# EAGLE design SmartDriveTestStand_SingleCape_v3 (EAGLE 9.2.2)
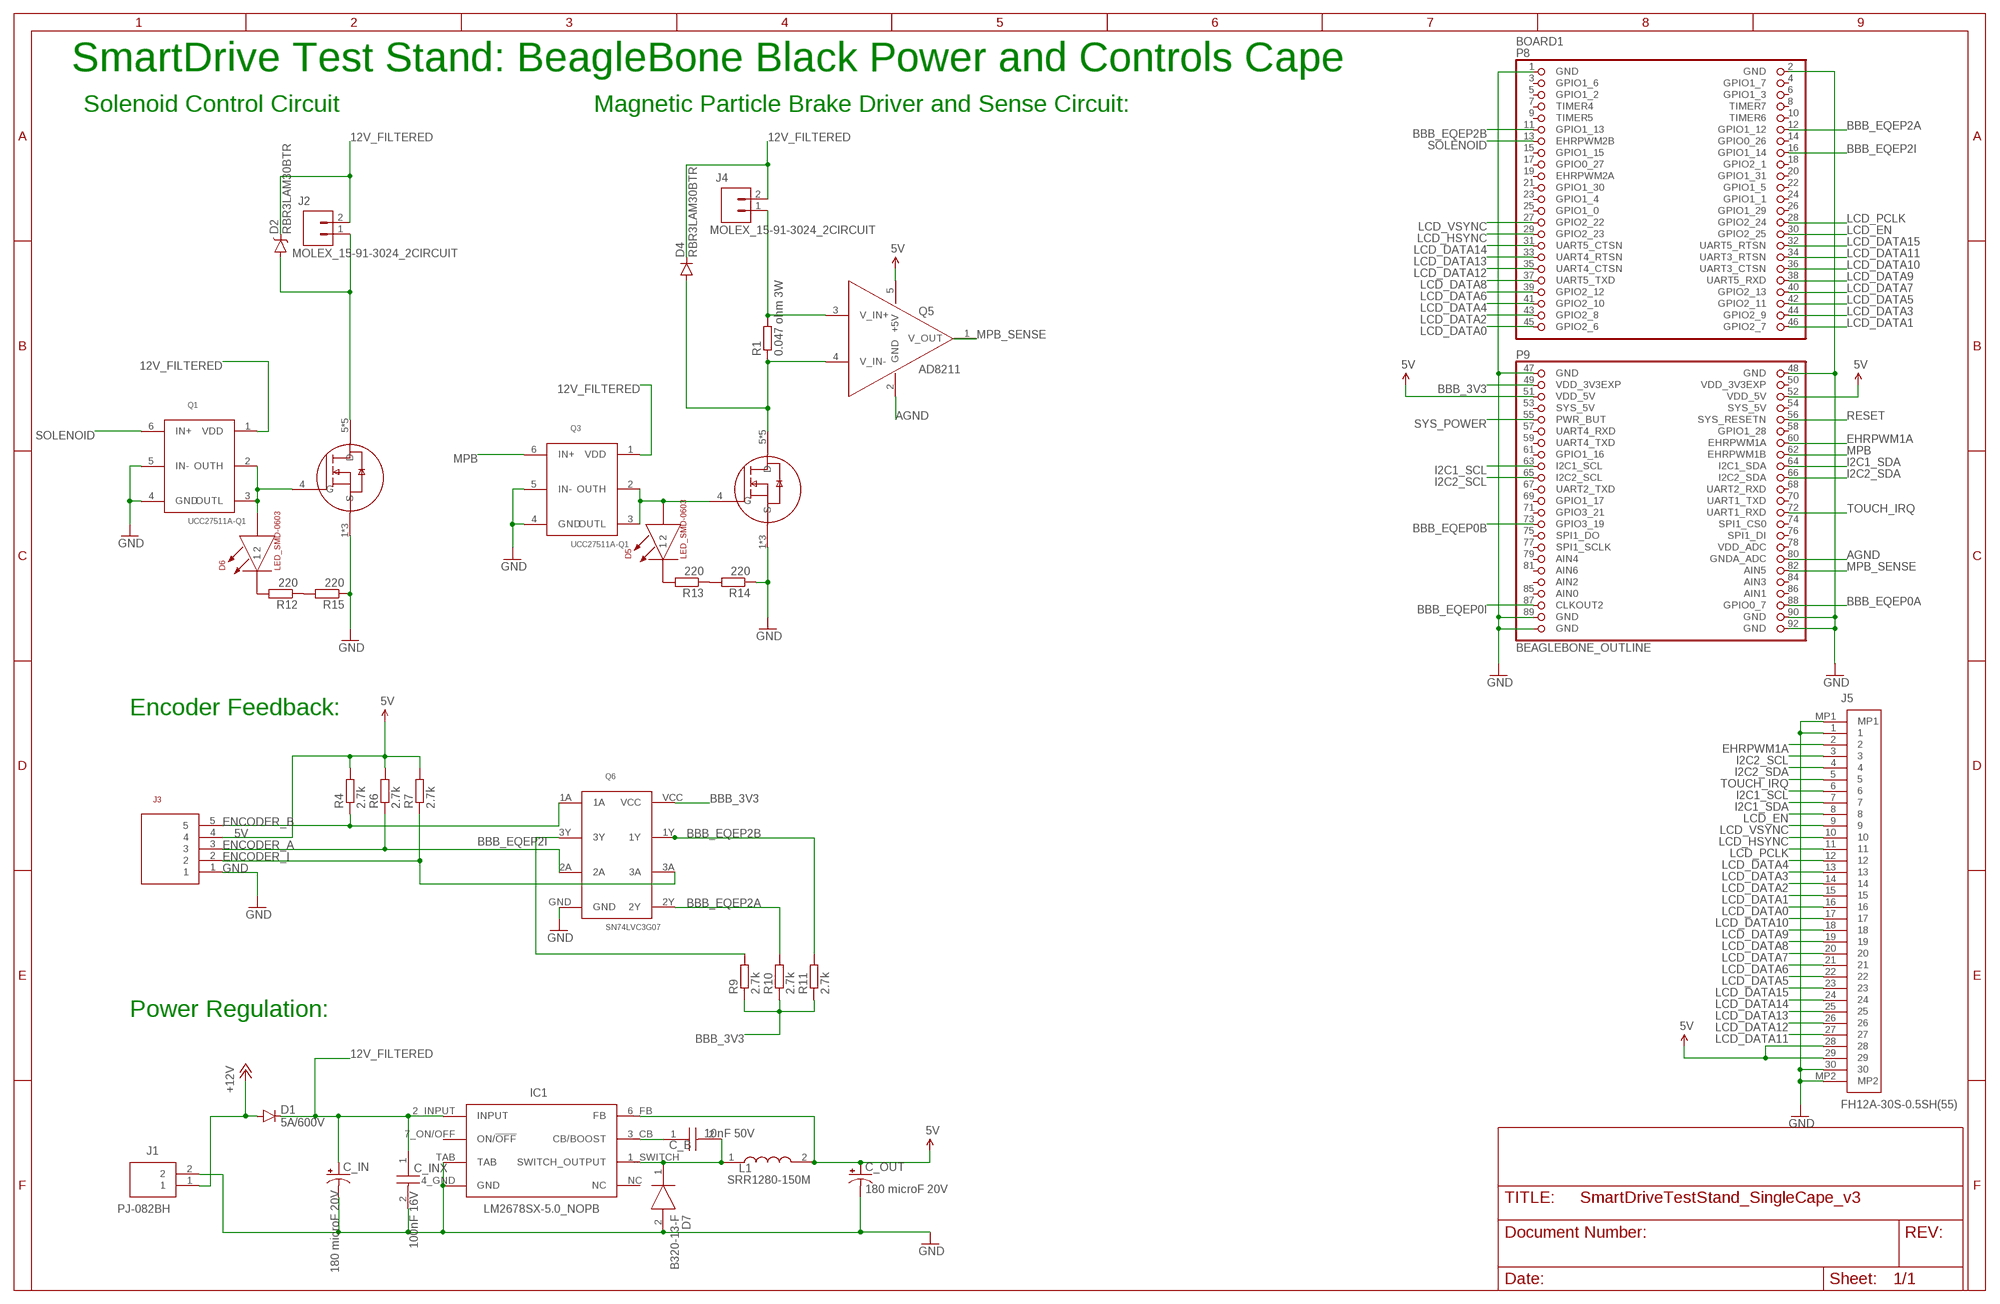
[diagram p0: schematic, sheet 1]

## Parts
BOARD1  BEAGLEBONE_OUTLINE  [BEAGLEBONE_SHIELD]
C_B  10nF 50V  CGA4C2C0G1H103J060AA  [CAPC2012X75N]
C_IN  180 microF 20V  20SVPF180M  [CAPAE1030X800N]
C_INX  100nF 16V  C0603X104K4RACTU  [CAPC1608X90N]
C_OUT  180 microF 20V  20SVPF180M  [CAPAE1030X800N]
D1  5A/600V  DIODEES3J  [SMC]
D2  RBR3LAM30BTR  DIODE-SCHOTTKYRBR3LAM30B  [SMA-DIODE]
D4  RBR3LAM30BTR  DIODESMA  [SMA-DIODE]
D5  LED_SMD-0603  [0603_LED]
D6  LED_SMD-0603  [0603_LED]
D7  B320-13-F  [DIOM7959X250N]
IC1  LM2678SX-5.0_NOPB  [KTW0007B]
J1  PJ-082BH  [PJ-082BH]
J2  MOLEX_15-91-3024_2CIRCUIT  [MOLEX15-91-3024_2CIRCUIT]
J3  MOLEX_15-91-3053_5CIRCUIT  [MOLEX15-91-3053-5CIRCUIT]
J4  MOLEX_15-91-3024_2CIRCUIT  [MOLEX15-91-3024_2CIRCUIT]
J5  FH12A-30S-0.5SH(55)  [FH12A30S05SH55]
L1  SRR1280-150M  [SRR1280-150M]
Q1  UCC27511A-Q1  [SOT23-6]
Q2  MOSFET_NCHANNELTI_CSD18533Q5A  [SON_5X6MM_NEXFET]
Q3  UCC27511A-Q1  [SOT23-6]
Q4  MOSFET_NCHANNELTI_CSD18533Q5A  [SON_5X6MM_NEXFET]
Q5  AD8211  [SOT23-5]
Q6  SN74LVC3G07  [SN74LVC3G07]
R1  0.047 ohm 3W  RESISTOR-2512  [RESISTOR-2512]
R4  2.7k  RESISTOR-0603  [RESISTOR-0603]
R6  2.7k  RESISTOR-0603  [RESISTOR-0603]
R7  2.7k  RESISTOR-0603  [RESISTOR-0603]
R9  2.7k  RESISTOR-0603  [RESISTOR-0603]
R10  2.7k  RESISTOR-0603  [RESISTOR-0603]
R11  2.7k  RESISTOR-0603  [RESISTOR-0603]
R12  220  RESISTOR-0603  [RESISTOR-0603]
R13  220  RESISTOR-0603  [RESISTOR-0603]
R14  220  RESISTOR-0603  [RESISTOR-0603]
R15  220  RESISTOR-0603  [RESISTOR-0603]

## Nets
5V: BOARD1.51(VDD_5V) BOARD1.52(VDD_5V) C_OUT.1(+) IC1.6_FB(FB) J3.4 J5.28 J5.29 L1.2 Q5.5(+5V) R4.P$2 R6.P$2 R7.P$2
12V_FILTERED: C_IN.1(+) C_INX.1 D1.C D2.C D4.C IC1.2_INPUT(INPUT) J2.2 J4.2 Q1.1(VDD) Q3.1(VDD)
+12V: D1.A J1.1
AGND: BOARD1.80(GNDA_ADC) Q5.2(GND)
BBB_3V3: BOARD1.49(VDD_3V3EXP) Q6.VCC R9.P$1 R10.P$1 R11.P$1
BBB_EQEP0A: BOARD1.88(GPIO0_7)
BBB_EQEP0B: BOARD1.73(GPIO3_19)
BBB_EQEP0I: BOARD1.87(CLKOUT2)
BBB_EQEP2A: BOARD1.12(GPIO1_12) Q6.2Y R10.P$2
BBB_EQEP2B: BOARD1.11(GPIO1_13) Q6.1Y R11.P$2
BBB_EQEP2I: BOARD1.16(GPIO1_14) Q6.3Y R9.P$2
EHRPWM1A: BOARD1.60(EHRPWM1A) J5.2
ENCODER_A: J3.3 Q6.2A R6.P$1
ENCODER_B: J3.5 Q6.1A R4.P$1
ENCODER_I: J3.2 Q6.3A R7.P$1
GND: BOARD1.1(GND) BOARD1.2(GND) BOARD1.47(GND) BOARD1.48(GND) BOARD1.89(GND) BOARD1.90(GND) BOARD1.91(GND) BOARD1.92(GND) C_IN.2(-) C_INX.2 C_OUT.2(-) D7.2(A) IC1.4_GND(GND) IC1.TAB J1.2 J3.1 J5.1 J5.30 J5.MP1 J5.MP2 Q1.4(GND) Q1.5(IN-) Q2.1(S) Q2.2(S) Q2.3(S) Q3.4(GND) Q3.5(IN-) Q4.1(S) Q4.2(S) Q4.3(S) Q6.GND R14.P$1 R15.P$1
I2C1_SCL: BOARD1.63(I2C1_SCL) J5.6
I2C1_SDA: BOARD1.64(I2C1_SDA) J5.7
I2C2_SCL: BOARD1.65(I2C2_SCL) J5.3
I2C2_SDA: BOARD1.66(I2C2_SDA) J5.4
LCD_DATA0: BOARD1.45(GPIO2_6) J5.16
LCD_DATA1: BOARD1.46(GPIO2_7) J5.15
LCD_DATA2: BOARD1.43(GPIO2_8) J5.14
LCD_DATA3: BOARD1.44(GPIO2_9) J5.13
LCD_DATA4: BOARD1.41(GPIO2_10) J5.12
LCD_DATA5: BOARD1.42(GPIO2_11) J5.22
LCD_DATA6: BOARD1.39(GPIO2_12) J5.21
LCD_DATA7: BOARD1.40(GPIO2_13) J5.20
LCD_DATA8: BOARD1.37(UART5_TXD) J5.19
LCD_DATA9: BOARD1.38(UART5_RXD) J5.18
LCD_DATA10: BOARD1.36(UART3_CTSN) J5.17
LCD_DATA11: BOARD1.34(UART3_RTSN) J5.27
LCD_DATA12: BOARD1.35(UART4_CTSN) J5.26
LCD_DATA13: BOARD1.33(UART4_RTSN) J5.25
LCD_DATA14: BOARD1.31(UART5_CTSN) J5.24
LCD_DATA15: BOARD1.32(UART5_RTSN) J5.23
LCD_EN: BOARD1.30(GPIO2_25) J5.8
LCD_HSYNC: BOARD1.29(GPIO2_23) J5.10
LCD_PCLK: BOARD1.28(GPIO2_24) J5.11
LCD_VSYNC: BOARD1.27(GPIO2_22) J5.9
MPB: BOARD1.62(EHRPWM1B) Q3.6(IN+)
MPB_SENSE: BOARD1.82(AIN5) Q5.1(V_OUT)
N$1: R13.P$1 R14.P$2
N$2: D4.A Q4.5(D) Q4.6(D) Q4.7(D) Q4.8(D) Q4.PAD(D) Q5.4(V_IN-) R1.1
N$3: D5.C R13.P$2
N$6: D6.C R12.P$2
N$7: D2.A J2.1 Q2.5(D) Q2.6(D) Q2.7(D) Q2.8(D) Q2.PAD(D)
N$8: J4.1 Q5.3(V_IN+) R1.2
N$9: R12.P$1 R15.P$2
N$10: D5.A Q3.2(OUTH) Q3.3(OUTL) Q4.4(G)
N$11: D6.A Q1.2(OUTH) Q1.3(OUTL) Q2.4(G)
N$12: C_B.2 D7.1(K) IC1.1_SWITCH(SWITCH_OUTPUT) L1.1
N$13: C_B.1 IC1.3_CB(CB/BOOST)
RESET: BOARD1.56(SYS_RESETN)
SOLENOID: BOARD1.13(EHRPWM2B) Q1.6(IN+)
SYS_POWER: BOARD1.55(PWR_BUT)
TOUCH_IRQ: BOARD1.72(UART1_RXD) J5.5
Unconnected: BOARD1.3(GPIO1_6) BOARD1.4(GPIO1_7) BOARD1.5(GPIO1_2) BOARD1.6(GPIO1_3) BOARD1.7(TIMER4) BOARD1.8(TIMER7) BOARD1.9(TIMER5) BOARD1.10(TIMER6) BOARD1.14(GPIO0_26) BOARD1.15(GPIO1_15) BOARD1.17(GPIO0_27) BOARD1.18(GPIO2_1) BOARD1.19(EHRPWM2A) BOARD1.20(GPIO1_31) BOARD1.21(GPIO1_30) BOARD1.22(GPIO1_5) BOARD1.23(GPIO1_4) BOARD1.24(GPIO1_1) BOARD1.25(GPIO1_0) BOARD1.26(GPIO1_29) BOARD1.54(SYS_5V) BOARD1.57(UART4_RXD) BOARD1.58(GPIO1_28) BOARD1.59(UART4_TXD) BOARD1.61(GPIO1_16) BOARD1.67(UART2_TXD) BOARD1.68(UART2_RXD) BOARD1.69(GPIO1_17) BOARD1.70(UART1_TXD) BOARD1.71(GPIO3_21) BOARD1.74(SPI1_CS0) BOARD1.75(SPI1_DO) BOARD1.76(SPI1_DI) BOARD1.77(SPI1_SCLK) BOARD1.78(VDD_ADC) BOARD1.79(AIN4) BOARD1.81(AIN6) BOARD1.83(AIN2) BOARD1.84(AIN3) BOARD1.86(AIN1) IC1.7_ON/OFF(ON/!OFF) IC1.NC

## Notes on the sheet
- SmartDrive Test Stand: BeagleBone Black Power and Controls Cape
- Solenoid Control Circuit | Magnetic Particle Brake Driver and Sense Circuit:
- Encoder Feedback:
- Power Regulation:

## Power pins joined to a net without a drawn wire
AIN0: BOARD1.85(AIN0)
SYS_5V: BOARD1.53(SYS_5V)
VDD_3V3EXP: BOARD1.50(VDD_3V3EXP)

## Library data of the parts
BOARD1 = SmartDrive-TestStand:BEAGLEBONE_OUTLINE: Should match A3 pinout - but not completely tested
C_B = SmartDrive-TestStand:CGA4C2C0G1H103J060AA: TDK 2012 CGA 10nF Ceramic Multilayer Capacitor, 50 V dc, +125C, C0G Dielectric, 5% Source: Datasheet <https://componentsearchengine.com/Datasheets/1/CGA4C2C0G1H103J060AA.pdf>; DESCRIPTION: TDK 2012 CGA 10nF Ceramic Multilayer Capacitor, 50 V dc, +125C, C0G Dielectric, 5%; HEIGHT: 0.75mm; MANUFACTURER_NAME: TDK; MANUFACTURER_PART_NUMBER: CGA4C2C0G1H103J060AA; MOUSER_PART_NUMBER: 810-CGA4C2C0G1H103J
C_IN C_OUT = SmartDrive-TestStand:20SVPF180M: Panasonic 180F 20 V dc Polymer Aluminium Electrolytic Capacitor E7, OS-CON Series 5000h 8 x 6.9mm Source: Datasheet <https://componentsearchengine.com/Datasheets/1/20SVPF180M.pdf>; DESCRIPTION: Panasonic 180F 20 V dc Polymer Aluminium Electrolytic Capacitor E7, OS-CON Series 5000h 8 x 6.9mm; HEIGHT: 8mm; MANUFACTURER_NAME: Panasonic; MANUFACTURER_PART_NUMBER: 20SVPF180M; MOUSER_PART_NUMBER: 667-20SVPF180M
C_INX = SmartDrive-TestStand:C0603X104K4RACTU: KEMET 100nF Multilayer Ceramic Capacitor MLCC 16V dc 10% X7R Dielectric 0603 (1608M), Max. Temp. +125C Source: Datasheet <https://componentsearchengine.com/Datasheets/1/C0603X104K4RACTU.pdf>; DESCRIPTION: KEMET 100nF Multilayer Ceramic Capacitor MLCC 16V dc 10% X7R Dielectric 0603 (1608M), Max. Temp. +125C; HEIGHT: 0.9mm; MANUFACTURER_NAME: Kemet; MANUFACTURER_PART_NUMBER: C0603X104K4RACTU; MOUSER_PART_NUMBER: 80-C0603X104K4R
D1 = SmartDrive-TestStand:DIODE: Diode These are standard reverse protection diodes and small signal diodes. SMA package can handle up to about 1A. SOD-323 can handle about 200mA. What the SOD-323 package when ordering, there are some mfgs out there that are 5-pin packages.; MANEX: 130-0001388; PROD_ID: DIO-12441; VALUE: 3A/600V
D2 = SmartDrive-TestStand:DIODE-SCHOTTKY: Schottky diodes
D4 = SmartDrive-TestStand:DIODE: Diode These are standard reverse protection diodes and small signal diodes. SMA package can handle up to about 1A. SOD-323 can handle about 200mA. What the SOD-323 package when ordering, there are some mfgs out there that are 5-pin packages.
D5 D6 = SmartDrive-TestStand:LED_SMD-0603
D7 = SmartDrive-TestStand:B320-13-F: Diodes Inc B320-13-F, SMT Schottky Diode, 20V 3A, 2-Pin DO-214AB Source: Datasheet <https://componentsearchengine.com/Datasheets/1/B320-13-F.pdf>; DESCRIPTION: Diodes Inc B320-13-F, SMT Schottky Diode, 20V 3A, 2-Pin DO-214AB; HEIGHT: 2.5mm; MANUFACTURER_NAME: Diodes Inc.; MANUFACTURER_PART_NUMBER: B320-13-F; MOUSER_PART_NUMBER: 621-B320-F
IC1 = SmartDrive-TestStand:LM2678SX-5.0_NOPB: SIMPLE SWITCHER 8V to 40V, 5A High Efficiency Step-Down DC/DC Switching Regulator Source: Datasheet <http://www.ti.com/lit/gpn/lm2678>; DESCRIPTION: SIMPLE SWITCHER 8V to 40V, 5A High Efficiency Step-Down DC/DC Switching Regulator; HEIGHT: mm; MANUFACTURER_NAME: Texas Instruments; MANUFACTURER_PART_NUMBER: LM2678SX-5.0/NOPB; MOUSER_PART_NUMBER: 926-LM2678SX50NOPB
J1 = SmartDrive-TestStand:PJ-082BH: DC Power Connectors 2.5mm x 5.5mm horz Source: Datasheet <https://componentsearchengine.com/Datasheets/1/PJ-082BH.pdf>; DESCRIPTION: DC Power Connectors 2.5mm x 5.5mm horz; HEIGHT: mm; MANUFACTURER_NAME: CUI; MANUFACTURER_PART_NUMBER: PJ-082BH; MOUSER_PART_NUMBER: 490-PJ-082BH
J2 J4 = SmartDrive-TestStand:MOLEX_15-91-3024_2CIRCUIT: MOLEX 15-91-3024 2 position connector; MANEX: 257-0004040
J3 = SmartDrive-TestStand:MOLEX_15-91-3053_5CIRCUIT
J5 = SmartDrive-TestStand:FH12A-30S-0.5SH(55): Hirose FH12 Series 0.5mm Pitch 30 Way 1 Row Right Angle SMT Female FPC Connector, Gold Plated Contacts Source: Datasheet <https://www.hirose.com/product/en/download_file/key_name/FH12A-30S-0.5SH(55)/category/Drawing (2D)/doc_file_id/43793/?file_category_id=6&item_id=05860556555&is_series=>; ARROW_PART_NUMBER: FH12A-30S-0.5SH(55); ARROW_PRICE-STOCK: https://www.arrow.com/en/products/fh12a-30s-0.5sh-55/hirose-electric; DESCRIPTION: Hirose FH12 Series 0.5mm Pitch 30 Way 1 Row Right Angle SMT Female FPC Connector, Gold Plated Contacts; HEIGHT: 3.6mm; MANUFACTURER_NAME: Hirose; MANUFACTURER_PART_NUMBER: FH12A-30S-0.5SH(55); RS_PART_NUMBER: 7148083P; RS_PRICE-STOCK: http://uk.rs-online.com/web/p/products/7148083P
L1 = SmartDrive-TestStand:SRR1280-150M: Power inductor SMD shielded 15uH Bourns SRR1280 Series Shielded Wire-wound SMD Inductor with a Ferrite Core, 15 H 20% 5.2A Idc Q:26 Source: Datasheet <https://componentsearchengine.com/Datasheets/1/SRR1280-150M.pdf>; DESCRIPTION: Power inductor SMD shielded 15uH Bourns SRR1280 Series Shielded Wire-wound SMD Inductor with a Ferrite Core, 15 H 20% 5.2A Idc Q:26; HEIGHT: mm; MANUFACTURER_NAME: Bourns; MANUFACTURER_PART_NUMBER: SRR1280-150M; MOUSER_PART_NUMBER: 652-SRR1280-150M
Q1 Q3 = SmartDrive-TestStand:UCC27511A-Q1
Q2 Q4 = SmartDrive-TestStand:MOSFET_NCHANNEL: N-Channel QFET MOSFET FQB30N06L 60V, 32A, 35mOhm
Q5 = SmartDrive-TestStand:AD8211: AD8211 Current Sense Amplifier
Q6 = SmartDrive-TestStand:SN74LVC3G07
R1 = SmartDrive-TestStand:RESISTOR-2512: Resistor SMD 2512
R4 R6 R7 R9-R15 = SmartDrive-TestStand:RESISTOR-0603: Resistor 0603 SMD

## Net classes
0 default: width 0.152 mm, drill 0.305 mm, clearance 0.152 mm

## Board
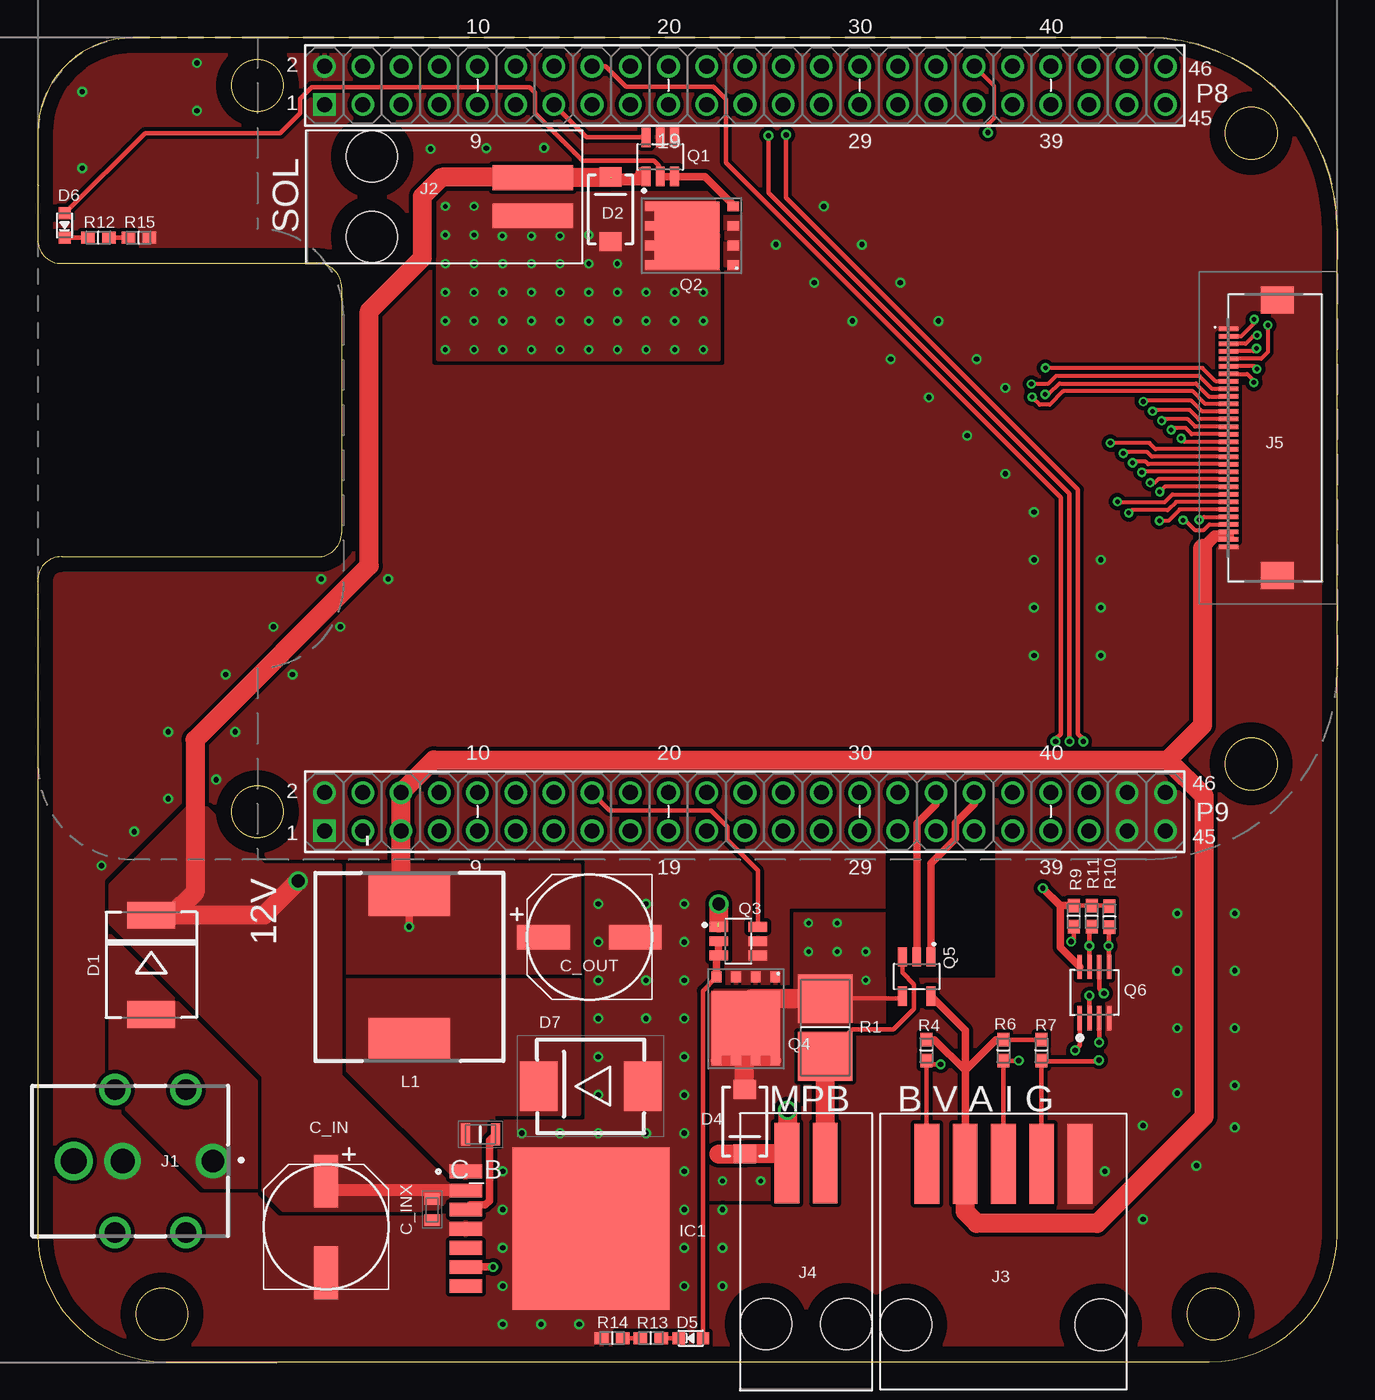
[diagram p1: board, top side]
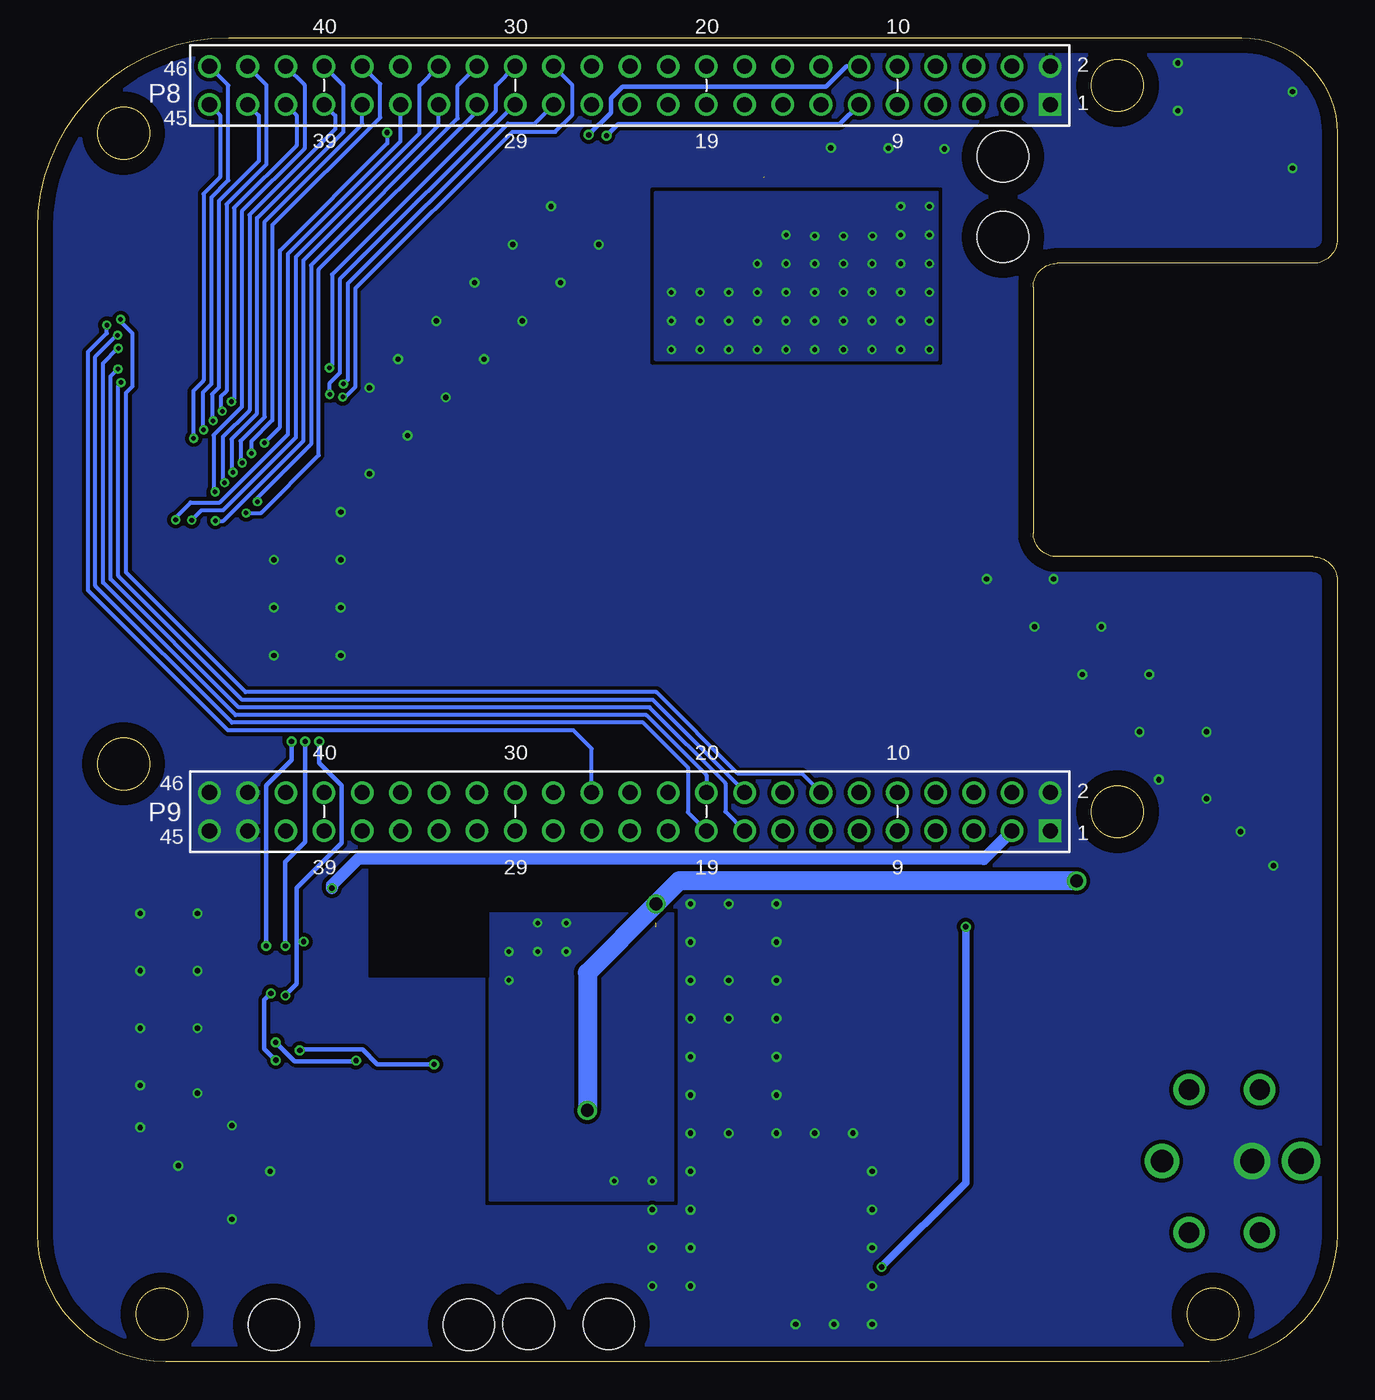
[diagram p2: board, bottom side, seen from below]

Size 86.36 x 88 mm. Coordinates in mm from the lower left corner, seen from the top.
Outline: 0,8.5 arc90 8.5,0 77.86,0 arc90 86.36,8.5 86.36,75.3 arc90 73.66,88 6.35,88 arc90 0,81.65 0,74.59 arc90 1.59,73 18.61,73 arc-90 20.2,71.41 20.2,55.09 arc-90 18.61,53.5 1.59,53.5 arc90 0,51.91 0,8.5
Outline: circle at 14.61,84.83 radius 1.73
Outline: circle at 80.65,81.65 radius 1.73
Outline: circle at 80.65,39.74 radius 1.73
Outline: circle at 14.61,36.56 radius 1.73
Outline: circle at 8.26,3.17 radius 1.73
Outline: circle at 78.11,3.17 radius 1.73
Copper layers (1*16): Top 0.035mm / dielectric 1.5mm / Bottom 0.035mm
Design rules "default *": minimum track width 10mil, minimum drill 10mil, track to track 10mil, track to pad 10mil, pad to pad 10mil, via to via 10mil, smd to smd 8mil, copper to edge 40mil, drill to drill 6mil, minimum pad ring 6mil, minimum via ring 6mil, stop-mask expansion 4mil, vias tented up to drill 15mil, thermal gap 0mil

### Footprints (pad centres in the part's own frame; a part is rotated, then mirrored left to right if it is on the bottom)
BEAGLEBONE_SHIELD = drill 1 square: 1 4.445,19.05; 47 52.705,19.05 | drill 1: 2 1.905,19.05; 3 4.445,21.59; 4 1.905,21.59; 5 4.445,24.13; 6 1.905,24.13; 7 4.445,26.67; 8 1.905,26.67; 9 4.445,29.21; 10 1.905,29.21; 11 4.445,31.75; 12 1.905,31.75; 13 4.445,34.29; 14 1.905,34.29; 15 4.445,36.83; 16 1.905,36.83; 17 4.445,39.37; 18 1.905,39.37; 19 4.445,41.91; 20 1.905,41.91; 21 4.445,44.45; 22 1.905,44.45; 23 4.445,46.99; 24 1.905,46.99; 25 4.445,49.53; 26 1.905,49.53; 27 4.445,52.07; 28 1.905,52.07; 29 4.445,54.61; 30 1.905,54.61; 31 4.445,57.15; 32 1.905,57.15; 33 4.445,59.69; 34 1.905,59.69; 35 4.445,62.23; 36 1.905,62.23; 37 4.445,64.77; 38 1.905,64.77; 39 4.445,67.31; 40 1.905,67.31; 41 4.445,69.85; 42 1.905,69.85; 43 4.445,72.39; 44 1.905,72.39; 45 4.445,74.93; 46 1.905,74.93; 48 50.165,19.05; 49 52.705,21.59; 50 50.165,21.59; 51 52.705,24.13; 52 50.165,24.13; 53 52.705,26.67; 54 50.165,26.67; 55 52.705,29.21; 56 50.165,29.21; 57 52.705,31.75; 58 50.165,31.75; 59 52.705,34.29; 60 50.165,34.29; 61 52.705,36.83; 62 50.165,36.83; 63 52.705,39.37; 64 50.165,39.37; 65 52.705,41.91; 66 50.165,41.91; 67 52.705,44.45; 68 50.165,44.45; 69 52.705,46.99; 70 50.165,46.99; 71 52.705,49.53; 72 50.165,49.53; 73 52.705,52.07; 74 50.165,52.07; 75 52.705,54.61; 76 50.165,54.61; 77 52.705,57.15; 78 50.165,57.15; 79 52.705,59.69; 80 50.165,59.69; 81 52.705,62.23; 82 50.165,62.23; 83 52.705,64.77; 84 50.165,64.77; 85 52.705,67.31; 86 50.165,67.31; 87 52.705,69.85; 88 50.165,69.85; 89 52.705,72.39; 90 50.165,72.39; 91 52.705,74.93; 92 50.165,74.93
CAPC2012X75N = smd 0.62 x 1.47: 1 -1,0; 2 1,0
CAPAE1030X800N = smd 3.5 x 1.6: 1 -3.05,0; 2 3.05,0
CAPC1608X90N = smd 0.78 x 0.98: 1 -0.7,0; 2 0.7,0
SMC = smd 1.778 x 3.175: A 3.302,0; C -3.302,0
SMA-DIODE = smd 1.27 x 1.47: A -2.15,0; C 2.15,0
0603_LED = smd 0.8 x 0.8: A 0.8,0; C -0.8,0
DIOM7959X250N = smd 2.5 x 3.3: 1 -3.45,0; 2 3.45,0
KTW0007B = smd 2.159 x 0.914: 1_SWITCH 8.331,-3.81; 2_INPUT 8.331,-2.54; 3_CB 8.331,-1.27; 4_GND 8.331,0; 6_FB 8.331,2.54; 7_ON/OFF 8.331,3.81; NC 8.331,1.27 | smd 10.414 x 10.795: TAB 0,0
PJ-082BH = drill 1.5 pad 2.3: 1 12,0 | drill 1.61 pad 2.4: 2 6,0 | drill 1.7 pad 2.5: 3 2.75,0 | drill 1.35 pad 2.1: 4 5.5,4.75; 5 10.2,4.75; 6 10.2,-4.75; 7 5.5,-4.75
MOLEX15-91-3024_2CIRCUIT = smd 1.65 x 5.33: 1 1.27,10.69; 2 -1.27,10.69 | hole 3.4: 2.67,0; -2.67,0
MOLEX15-91-3053-5CIRCUIT = smd 1.65 x 5.33: 1 5.08,10.69; 2 2.54,10.69; 3 0,10.69; 4 -2.54,10.69; 5 -5.08,10.69 | hole 3.4: 6.48,0; -6.48,0
FH12A30S05SH55 = smd 0.3 x 1.3: 1 -7.25,-2.625; 2 -6.75,-2.625; 3 -6.25,-2.625; 4 -5.75,-2.625; 5 -5.25,-2.625; 6 -4.75,-2.625; 7 -4.25,-2.625; 8 -3.75,-2.625; 9 -3.25,-2.625; 10 -2.75,-2.625; 11 -2.25,-2.625; 12 -1.75,-2.625; 13 -1.25,-2.625; 14 -0.75,-2.625; 15 -0.25,-2.625; 16 0.25,-2.625; 17 0.75,-2.625; 18 1.25,-2.625; 19 1.75,-2.625; 20 2.25,-2.625; 21 2.75,-2.625; 22 3.25,-2.625; 23 3.75,-2.625; 24 4.25,-2.625; 25 4.75,-2.625; 26 5.25,-2.625; 27 5.75,-2.625; 28 6.25,-2.625; 29 6.75,-2.625; 30 7.25,-2.625 | smd 1.8 x 2.2: MP1 -9.15,0.625; MP2 9.15,0.625
SRR1280-150M = smd 2.9 x 5.4: 1 -4.85,0; 2 4.85,0
SOT23-6 = smd 1.27 x 0.635: 1 -1.3,0.95; 2 -1.3,0; 3 -1.3,-0.95; 4 1.3,-0.95; 5 1.3,0; 6 1.3,0.95
SON_5X6MM_NEXFET = smd 0.75 x 0.65: 1 3.075,-1.95; 2 3.075,-0.65; 3 3.075,0.65; 4 3.075,1.95 | smd 0.65 x 0.65: 5 -2.475,1.95; 6 -2.475,0.65; 7 -2.475,-0.65; 8 -2.475,-1.95 | smd 4.3 x 4.55: PAD 0,0
SOT23-5 = smd 1.27 x 0.635: 1 -1.3,0.95; 2 -1.3,0; 3 -1.3,-0.95; 4 1.3,-0.95; 5 1.3,0.95
SN74LVC3G07 = smd 0.3 x 1.6: 1A -0.975,-1.7; 1Y -0.325,1.7; 2A 0.325,-1.7; 2Y 0.975,1.7; 3A 0.325,1.7; 3Y -0.325,-1.7; GND 0.975,-1.7; VCC -0.975,1.7
RESISTOR-2512 = smd 3.25 x 3.6: 1 -1.925,0; 2 1.925,0
RESISTOR-0603 = smd 0.9 x 0.8: P$1 -0.7,0; P$2 0.7,0

### Placement (x,y rotation side)
BOARD1  0.01,88 270 top
C_B  29.43,15.12 180 top
C_IN  19.17,8.97 270 top
C_INX  26.21,10.12 270 top
C_OUT  36.67,28.23 0 top
D1  7.55,26.39 270 top
D2  38.07,76.59 90 top
D4  46.99,15.96 270 top
D5  43.4,1.58 0 top
D6  1.8,75.52 90 top
D7  36.75,18.32 0 top
DRILEGEND  [DRILEGEND]  10.55,33.13 0 top
IC1  36.78,8.85 180 top
J1  -0.35,13.35 0 top
J2  22.22,77.43 270 top
J3  64.18,2.47 0 top
J4  51.07,2.51 0 top
J5  81.76,61.4 270 top
L1  24.71,26.25 90 top
Q1  41.37,80.07 90 top
Q2  43.15,74.83 0 top
Q3  46.56,27.96 0 top
Q4  47.07,22.5 90 top
Q5  58.42,25.61 270 top
Q6  70.23,24.54 0 top
R1  52.34,22.22 270 top
R4  59.06,20.71 90 top
R6  64.17,20.71 90 top
R7  66.7,20.71 90 top
R9  68.86,29.62 270 top
R10  71.23,29.6 270 top
R11  70.05,29.62 270 top
R12  4.03,74.72 180 top
R13  40.74,1.58 0 top
R14  38.17,1.58 0 top
R15  6.73,74.72 180 top

### Tracks (layer width: path | path; a pad name or v marks a point on that pad's centre or on a via)
5V  (via drill 0.35)
  Top 0.254: 79.14,54.88 J5.29 J5.28
  Top 0.305: R6.P$2 R7.P$2
  Top 0.508: IC1.6_FB v30.27,6.31 | v24.68,28.91 24.68,31.07 L1.2 | J3.4 61.64,19.36 | 61.64,19.36 61.64,22.04 Q5.5 | R4.P$2 59.59,21.41 61.64,19.36 | 61.64,19.36 63.69,21.41 R6.P$2
  Top 0.762: 77.41,54.06 78.24,54.88 79.14,54.88
  Top 1.27: 75.12,40.01 26.32,40.01 BOARD1.52 BOARD1.51 24.14,31.66 L1.2 | 75.12,40.01 77.5,37.63 77.5,16.29 70.41,9.2 62.42,9.2 61.63,9.99 61.63,13.15 J3.4 | 75.12,40.01 77.41,42.31 77.41,54.06
  Bottom 0.508: v30.27,6.31 24.68,11.89 v24.68,28.91
  pour Top (rank 3): 20.11,32.98 20.11,25.36 35.99,25.36 35.99,32.98
12V_FILTERED  (via drill 0.85)  (2 unrouted)
  Top 0.305: C_INX.1 26.78,11.39 IC1.2_INPUT
  Top 0.508: 38.19,78.77 38.11,78.7 | 40.1,79 40.1,78.77 Q1.1
  Top 0.813: IC1.2_INPUT 19.81,11.39 C_IN.1 | 38.28,78.53 D2.C 38.25,78.56 40.1,78.56 40.1,79
  Top 1.27: J2.2 32.88,78.72 26.84,78.72 25.57,77.45 25.57,73.37 22.04,69.84 22.04,52.9 10.47,41.33 10.47,31.21 8.95,29.69 D1.C 15.05,29.69 v17.32,31.96 | J2.2 32.96,78.75 | 45.27,13.81 D4.C 49.19,13.81 J4.2 49.83,13.2 v49.83,16.72 | v45.26,30.44 v45.26,30.43 45.26,29.16 | J2.2 32.91,78.74 D2.C
  Bottom 1.27: v17.32,31.96 43.73,31.96 v45.26,30.44 49.83,25.86 v49.83,16.72
  pour Top: 4.87,29.17 15.03,19.01 15.03,11.39 16.3,10.12 26.46,10.12 27.73,11.39 20.11,19.01 20.11,32.98 15.03,32.98 11.22,36.79 9.95,36.79 4.87,31.71
+12V
  pour Top (rank 2): 15.03,11.64 11.1,11.64 4.87,17.86 4.87,29.17 15.03,19.01
AGND
  Top 0.508: Q5.2 58.42,34.76 58.42,34.77 58.42,35.79 59.18,36.55 59.2,36.55 59.7,37.05 BOARD1.80
AGND_CUTOUT
  cutout Top: 56.43,25.61 56.43,38.56 63.55,38.56 63.55,25.61
  cutout Bottom: 56.43,38.56 56.43,25.61 64.31,25.61 64.31,38.56
BBB_3V3  (via drill 0.35)
  Top 0.305: R10.P$1 71.2,30.32 R11.P$1 R9.P$1
  Top 0.508: 67.95,30.32 v66.8,31.48 67.84,30.43 | 67.95,30.32 R9.P$1 | Q6.VCC 67.95,27.54 67.95,30.32
  Bottom 0.813: BOARD1.49 23.49,33.41 65.07,33.41 66.8,31.68 v66.8,31.48
BBB_EQEP2A  (via drill 0.35)
  Top 0.305: Q6.2Y 71.2,27.61 v71.17,27.64 71.19,27.67 71.19,28.86 R10.P$2 | v69.49,41.23 69.49,41.38 69.13,41.74 69.13,57.96 49.74,77.35 v49.74,81.54
  Bottom 0.305: v49.74,81.54 48.26,83.02 48.26,83.96 47.49,84.73 33.97,84.73 32.61,86.09 BOARD1.12 | v69.49,41.23 69.49,39.99 71.17,38.31 v71.17,27.64
BBB_EQEP2B  (via drill 0.35)
  Top 0.305: Q6.1Y v69.9,27.64 69.9,28.76 R11.P$2 | v68.58,41.23 68.58,57.69 48.56,77.7 v48.56,81.49
  Bottom 0.305: v48.56,81.49 47.8,82.25 33.06,82.25 BOARD1.11 | v69.9,27.64 69.9,33.23 68.58,34.55 v68.58,41.23
BBB_EQEP2I  (via drill 0.35)
  Top 0.305: BOARD1.16 37.74,86.09 39.1,84.73 44.92,84.73 45.75,83.91 45.75,79.68 67.99,57.44 67.99,41.73 67.64,41.38 v67.64,41.23 | Q6.3Y v69.9,24.34 | v68.68,27.92 68.86,28.1 R9.P$2
  Bottom 0.305: 69.13,27.92 69.13,31.5 66.17,34.47 66.17,38.31 67.64,39.79 v67.64,41.23 | 69.13,27.92 69.13,25.1 v69.9,24.34 | 69.13,27.92 v68.68,27.92
EHRPWM1A  (via drill 0.3)
  Top 0.254: J5.2 79.98,68.15 80.84,69.02 v80.84,69.27
  Bottom 0.254: v80.84,69.27 80.84,69.12 80.06,68.33 80.06,64.83 80.49,64.4 80.49,52.46 72.54,44.51 45.25,44.51 39.84,39.1 35.57,39.1 BOARD1.60
ENCODER_A  (via drill 0.35)
  Top 0.305: J3.3 R6.P$1 65.19,20.01 v65.2,20.02 | v70.53,21.24 70.55,21.26 Q6.2A
  Bottom 0.305: v65.2,20.02 65.25,19.97 69.27,19.97 v70.53,21.24
ENCODER_B  (via drill 0.35)
  Top 0.305: J3.5 59.06,13.2 R4.P$1 59.3,19.77 v60.01,19.77 | v68.94,20.7 69.25,21.02 Q6.1A
  Bottom 0.305: v60.01,19.77 63.78,19.77 64.77,20.76 68.89,20.76 v68.94,20.7
ENCODER_I  (via drill 0.35)
  Top 0.305: J3.2 66.7,13.18 R7.P$1 66.75,19.96 70.44,19.96 v70.53,20.05 | Q6.3A 70.56,24.8 v70.86,24.49
  Bottom 0.305: v70.86,24.49 71.29,24.06 71.29,20.81 v70.53,20.05
GND  (via drill 0.35)
  other vias: 75.74,17.86 75.74,25.99 73.45,15.7 70.91,12.66 75.74,22.18 75.74,29.8 13.13,41.87 16.94,45.68 20.11,48.85 23.29,52.03 18.84,52.03 15.67,48.85 12.49,45.68 8.68,41.87 11.86,38.69 6.42,35.24 26.11,80.6 33.65,80.68 10.59,83.14 10.59,86.32 2.97,84.41 2.97,79.33 4.24,32.98 42.97,30.44 42.97,27.9 42.97,25.36 42.97,22.82 42.97,20.28 40.43,30.44 37.26,30.44 37.26,27.9 37.26,25.36 40.43,25.36 40.43,22.82 37.26,22.82 37.26,20.28 37.26,17.74 37.26,15.2 40.43,15.2 42.97,15.2 42.97,17.74 42.97,12.66 42.97,10.12 42.97,7.58 42.97,5.04 34.72,15.2 32.18,15.2 30.91,12.66 30.91,10.12 30.91,7.58 30.91,5.04 30.91,2.5 33.45,2.5 79.55,29.8 79.55,25.99 79.55,22.18 79.55,18.37 79.55,15.58 77.01,13.04 73.45,9.48 8.68,37.42 45.51,10.12 45.51,7.58 45.51,5.04 35.99,2.5 70.66,46.95 70.66,50.12 70.66,53.3 66.21,46.95 66.21,50.12 66.21,53.3 66.21,56.47 64.31,59.01 61.77,61.55 59.23,64.09 56.69,66.63 54.15,69.17 51.61,71.71 49.07,74.25 52.24,76.79 54.78,74.25 57.32,71.71 59.86,69.17 62.4,66.63 64.31,64.73 29.82,80.65
  pour Bottom (rank 6): -0.34,89.01 -0.34,-1.49 91.2,-1.49 91.2,89.01
  pour Top (rank 6): -0.11,89.01 -0.11,-1.41 91.17,-1.41 91.17,89.01
I2C1_SCL  (via drill 0.3)
  Top 0.254: J5.6 80.84,66.16 v81.02,65.98
  Bottom 0.254: v81.02,65.98 v81.03,65.98 81.5,65.5 81.5,52.01 72.99,43.49 45.69,43.49 40.66,38.46 40.66,36.57 BOARD1.63
I2C1_SDA  (via drill 0.3)
  Top 0.254: J5.7 80.38,65.65 80.82,65.21 v80.82,65.08
  Bottom 0.254: BOARD1.64 39.38,37.91 45.47,44 72.76,44 81,52.23 81,64.88 80.82,65.06 v80.82,65.08
I2C2_SCL  (via drill 0.3)
  Top 0.254: J5.3 80.28,67.65 80.86,68.22 v81.05,68.22
  Bottom 0.254: v81.05,68.22 81.1,68.22 82.52,66.81 82.52,51.56 73.43,42.48 46.12,42.48 43.15,39.5 43.15,36.52 BOARD1.65
I2C2_SDA  (via drill 0.3)
  Top 0.254: J5.4 80.79,67.15 v81,67.35
  Bottom 0.254: v81,67.35 81.02,67.35 82.01,66.36 82.01,51.79 73.21,42.98 45.91,42.98 41.92,39 BOARD1.66
LCD_DATA0  (via drill 0.3)
  Top 0.254: J5.16 76.21,61.15 v75.99,61.37
  Bottom 0.254: v75.99,61.37 76.02,61.4 76.02,64.52 75.33,65.21 75.33,77.63 74.23,78.73 74.23,82.84 BOARD1.45
LCD_DATA1  (via drill 0.3)
  Top 0.254: J5.15 76.7,61.65 76.29,62.06 75.46,62.06 v75.33,61.93
  Bottom 0.254: v75.33,61.93 75.38,61.98 75.38,64.42 74.82,64.98 74.82,77.37 73.69,78.51 73.69,84.83 BOARD1.46
LCD_DATA2  (via drill 0.3)
  Top 0.254: v74.7,62.54 74.8,62.64 76.44,62.64 76.93,62.15 J5.14
  Bottom 0.254: v74.7,62.54 74.77,62.62 74.77,64.29 74.32,64.75 74.32,77.14 71.67,79.79 71.67,82.81 BOARD1.43
LCD_DATA3  (via drill 0.3)
  Top 0.254: J5.13 77.16,62.64 76.56,63.25 74.16,63.25 v74.09,63.18
  Bottom 0.254: v74.09,63.18 74.19,63.28 74.19,64.14 73.81,64.52 73.81,76.92 71.14,79.58 71.14,84.84 72.39,86.09 BOARD1.44
LCD_DATA4  (via drill 0.3)
  Top 0.254: J5.12 77.39,63.15 76.68,63.86 73.53,63.86 v73.48,63.81
  Bottom 0.254: v73.48,63.81 73.3,63.99 73.3,76.69 69.15,80.83 69.15,82.84 BOARD1.41
LCD_DATA5  (via drill 0.3)
  Top 0.254: J5.22 74.9,58.15 v74.57,57.82
  Bottom 0.254: BOARD1.42 68.63,84.85 68.63,80.63 72.79,76.46 72.79,63.46 74.67,61.58 74.67,57.92 v74.57,57.82
LCD_DATA6  (via drill 0.3)
  Top 0.254: J5.21 74.46,58.65 74.24,58.43 v73.94,58.43
  Bottom 0.254: v73.94,58.43 74.06,58.55 74.06,61.45 72.28,63.23 72.28,76.23 66.59,81.93 66.59,82.81 BOARD1.39
LCD_DATA7  (via drill 0.3)
  Top 0.254: J5.20 73.38,59.15 v73.38,59.11
  Bottom 0.254: v73.38,59.11 73.48,59.21 73.48,61.31 71.78,63.02 71.78,76 66.04,81.74 66.04,84.8 BOARD1.40
LCD_DATA8  (via drill 0.3)
  Top 0.254: J5.19 73.8,59.65 73.63,59.82 72.84,59.82 v72.77,59.75
  Bottom 0.254: v72.77,59.75 72.87,59.85 72.87,61.19 71.27,62.79 71.27,75.77 64.78,82.26 BOARD1.37
LCD_DATA9  (via drill 0.3)
  Top 0.254: J5.18 74.04,60.15 73.75,60.45 72.22,60.45 v72.15,60.37
  Bottom 0.254: v72.15,60.37 72.15,61.18 70.76,62.57 70.76,75.52 63.6,82.68 63.6,84.91 BOARD1.38
LCD_DATA10  (via drill 0.3, 0.35)
  Top 0.254: J5.17 74.29,60.65 73.88,61.06 v71.29,61.06 | v63.14,81.69 63.17,81.72 63.17,82.25 63.57,82.66 63.57,84.76 BOARD1.36
  Bottom 0.254: v71.29,61.06 71.29,61.09 70.25,62.12 70.25,73.85 63.12,80.98 63.13,81.39 v63.14,81.69
LCD_DATA11  (via drill 0.3)
  Top 0.254: J5.27 77.86,55.66 77.48,55.28 76.89,55.28 76.23,55.94 v76.12,55.94
  Bottom 0.254: v76.12,55.94 75.46,56.6 74.04,56.6 69.21,61.42 69.21,73.42 60.99,81.64 60.99,84.81 BOARD1.34
LCD_DATA12  (via drill 0.3)
  Top 0.254: J5.26 77.5,56.15 77.31,55.96 v77.19,55.96
  Bottom 0.254: v77.19,55.96 77.19,56.11 76.2,57.11 74.26,57.11 69.72,61.64 69.72,73.64 62.24,81.12 BOARD1.35
LCD_DATA13  (via drill 0.3)
  Top 0.254: J5.25 75.89,56.65 75.13,55.89 v74.55,55.89
  Bottom 0.254: v74.55,55.89 74.02,55.89 68.7,61.2 68.7,73.18 59.7,82.18 BOARD1.33
LCD_DATA14  (via drill 0.3)
  Top 0.254: J5.24 75.66,57.15 75.1,56.59 72.68,56.59 v72.51,56.41
  Bottom 0.254: v72.51,56.41 71.52,56.41 67.68,60.25 67.68,72.61 57.16,83.12 BOARD1.31
LCD_DATA15  (via drill 0.3)
  Top 0.254: J5.23 75.42,57.65 74.88,57.11 71.81,57.11 v71.76,57.16
  Bottom 0.254: v71.76,57.16 71.76,57.41 68.19,60.98 68.19,72.88 58.44,82.63 58.44,84.81 BOARD1.32
LCD_EN  (via drill 0.3)
  Top 0.254: v66.98,66.06 66.99,66.04 77.41,66.04 78.3,65.15 J5.8
  Bottom 0.254: v66.98,66.06 66.8,66.23 66.8,72.25 55.9,83.15 55.9,84.81 BOARD1.30
LCD_HSYNC  (via drill 0.3)
  Top 0.254: J5.10 77.84,64.15 76.98,65.01 67.9,65.01 67.18,64.29 v66.95,64.29
  Bottom 0.254: v66.95,64.29 66.95,65.06 66.29,65.72 66.29,71.94 54.68,83.55 BOARD1.29
LCD_PCLK  (via drill 0.3)
  Top 0.254: J5.11 77.61,63.66 76.77,64.5 68.14,64.5 67.25,63.61 66.59,63.61 v66.09,64.12
  Bottom 0.254: v66.09,64.12 65.91,64.12 65.25,64.78 65.25,71.3 54.81,81.74 51.96,81.74 50.82,82.89 50.82,84.83 BOARD1.28
LCD_VSYNC  (via drill 0.3)
  Top 0.254: J5.9 78.07,64.65 77.2,65.52 67.67,65.52 67.13,64.98 v66.04,64.98
  Bottom 0.254: v66.04,64.98 65.76,65.26 65.76,71.63 55.11,82.28 53.33,82.28 52.08,83.53 BOARD1.27
MPB
  Top 0.305: BOARD1.62 38.02,36.66 44.73,36.66 45.85,35.54 45.85,34.69 47.86,32.67 Q3.6
MPB_SENSE
  Top 0.508: Q5.1 59.37,33.14 60.99,34.76 60.99,35.81 62.24,37.07 BOARD1.82
N$1
  Top 0.305: R13.P$1 R14.P$2
N$2  (via drill 0.3)
  Top 0.254: Q4.6 46.99,19.46 D4.A
  Top 0.305: R1.1 57.3,24.14 Q5.4
  Top 0.762: Q4.5 Q4.6 Q4.7 Q4.8
  Top 1.27: R1.1 47.45,24.14 47.07,23.76 Q4.PAD 46.99,22.42 D4.A
  other vias: 51.23,29.17 53.13,29.17 51.23,27.26 53.13,27.26 55.04,27.26 55.04,25.36 48.05,12.02 45.51,12.02
  pour Top: 44.57,24.72 44.57,10.78 50.59,10.78 50.59,22.18 56.31,22.18 56.31,29.8 50.29,29.8 50.29,24.72
  pour Bottom: 44.14,29.8 44.14,10.75 56.31,10.75 56.31,29.8
N$3
  Top 0.305: D5.C R13.P$2
N$6
  Top 0.305: D6.C | D6.C R12.P$2
N$7  (via drill 0.3)
  Top 0.254: Q2.7 42.5,74.18 Q2.PAD
  other vias: 27.1,67.27 29,67.27 30.91,67.27 32.81,67.27 34.72,67.27 36.62,67.27 38.53,67.27 40.43,67.27 42.34,67.27 44.24,67.27 44.24,69.17 44.24,71.08 42.34,71.08 40.43,71.08 38.53,71.08 38.53,72.98 27.1,69.17 27.1,71.08 27.1,72.98 27.1,74.89 27.1,76.79 29,76.79 29,74.89 29,72.98 29,71.08 29,69.17 30.91,69.17 30.91,71.08 30.91,72.98 30.88,74.81 32.81,74.81 32.81,72.98 32.81,71.08 32.81,69.17 34.72,69.17 34.72,71.08 34.72,72.98 34.72,74.81 36.62,74.89 36.62,72.98 36.62,71.08 36.62,69.17 38.53,69.17 40.43,69.17 42.34,69.17
  pour Top: 26.59,77.73 45.28,77.73 45.28,66.58 26.59,66.58
  pour Bottom: 26.59,66.58 45.28,66.58 45.28,77.73 26.59,77.73
N$8
  Top 0.305: R1.2 54.16,22.11 56.88,22.11 58.24,23.47 58.24,25.1 57.47,25.87 Q5.3
  Top 1.27: J4.1 R1.2
N$9
  Top 0.305: R12.P$1 R15.P$2
N$10
  Top 0.305: Q4.4 44.2,24.66 D5.A
  Top 0.508: Q4.4 45.12,26.86 Q3.3 Q3.2
N$11
  Top 0.305: Q1.2 41.29,78.86 41.29,79.47 40.95,79.81 36.23,79.81 33.07,82.97 33.07,84.33 32.69,84.71 18.22,84.71 17.45,83.94 17.45,82.98 16.13,81.65 7.13,81.65 D6.A
  Top 0.508: Q2.4 46.29,76.84 44.36,78.77 Q1.3 Q1.2
N$12
  pour Top (rank 2): 20.11,25.36 35.99,25.36 35.99,16.47 30.27,16.47 30.27,11.39 23.92,11.39 23.92,15.2 20.11,19.01
N$13
  Top 0.508: IC1.3_CB 28.75,10.42 29.73,10.42 30.03,10.72 30.03,14.72 C_B.1
SOLENOID
  Top 0.305: Q1.6 36.49,81.37 BOARD1.13
TOUCH_IRQ  (via drill 0.3)
  Top 0.254: J5.5 81.3,66.66 81.76,67.11 v81.76,68.89
  Bottom 0.254: v81.76,68.89 81.76,68.36 83.03,67.09 83.03,51.29 73.71,41.97 50.76,41.97 49.54,40.75 BOARD1.72

### Text on the board
tPlace: SOL | - | 12V | MPB | B V A I G